# EAGLE design Poke_2_3 (EAGLE 6.5.0)
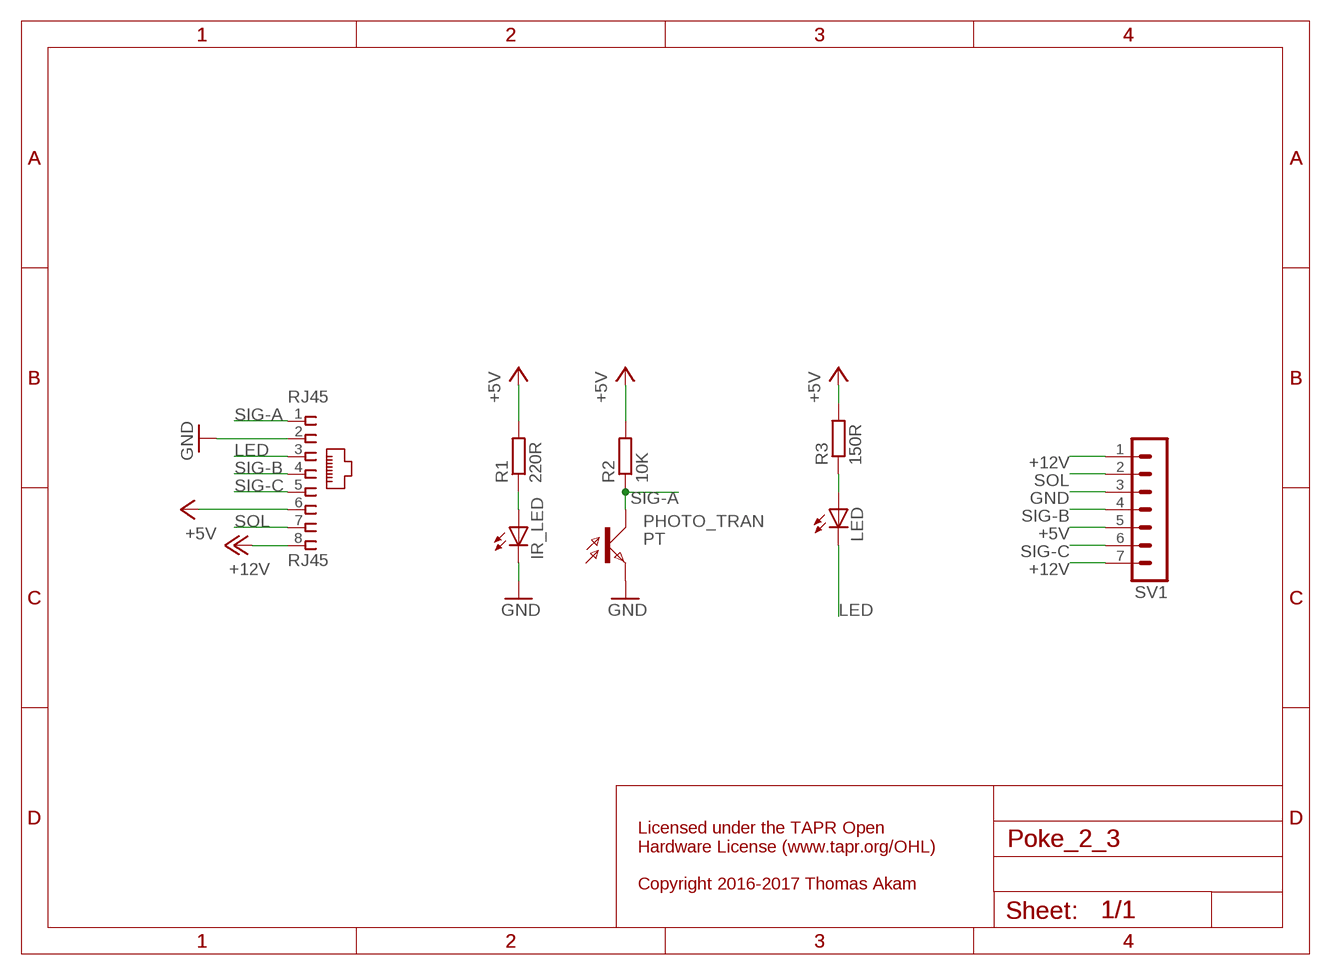
[diagram p0: schematic, sheet 1]

## Parts
IR_LED  LEDIRL80A  [IRL80A]
LED  LEDSML0805  [SML0805]
PHOTO_TRAN  PT  LPT80A  [LPT80A]
R1  220R  R-EU_R0805  [R0805]
R2  10K  R-EU_M0805  [M0805]
R3  150R  R-EU_M0805  [M0805]
RJ45  RJ45  RJ45VERTICAL  [RJ45-NO-SHIELD-VERTICAL]
SV1  MA07-1  [MA07-1]

## Nets
+5V: R1.2 R2.2 R3.2 RJ45.6 SV1.5
+12V: RJ45.8 SV1.1 SV1.7
GND: IR_LED.K(C) PHOTO_TRAN.E RJ45.2 SV1.3
LED: LED.C RJ45.3
N$1: IR_LED.A R1.1
N$10: LED.A R3.1
SIG-A: PHOTO_TRAN.C R2.1 RJ45.1
SIG-B: RJ45.4 SV1.4
SIG-C: RJ45.5 SV1.6
SOL: RJ45.7 SV1.2

## Notes on the sheet
- Licensed under the TAPR Open
  Hardware License (www.tapr.org/OHL)
  
  Copyright 2016-2017 Thomas Akam

## Library data of the parts
IR_LED LED = led:LED: LED OSRAM: - CHIPLED LG R971, LG N971, LY N971, LG Q971, LY Q971, LO R971, LY R971 LH N974, LH R974 LS Q976, LO Q976, LY Q976 LO Q996 - Hyper CHIPLED LW Q18S LB Q993, LB Q99A, LB R99A - SideLED LS A670, LO A670, LY A670, LG A670, LP A670 LB A673, LV A673, LT A673, LW A673 LH A674 LY A675 LS A676, LA A676, LO A676, LY A676, LW A676 LS A679, LY A679, LG A679 - Hyper Micro SIDELED® LS Y876, LA Y876, LO Y876, LY Y876 LT Y87S - SmartLED LW L88C, LW L88S LB L89C, LB L89S, LG L890 LS L89K, LO L89K, LY L89K LS L896, LA L896, LO L896, LY L896 - TOPLED LS T670, LO T670, LY T670, LG T670, LP T670 LSG T670, LSP T670, LSY T670, LOP T670, LYG T670 LG T671, LOG T671, LSG T671 LB T673, LV T673, LT T673, LW T673 LH T674 LS T676, LA T676, LO T676, LY T676, LB T676, LH T676, LSB T676, LW T676 LB T67C, LV T67C, LT T67C, LS T67K, LO T67K, LY T67K, LW E67C LS E67B, LA E67B, LO E67B, LY E67B, LB E67C, LV E67C, LT E67C LW T67C LS T679, LY T679, LG T679 LS T770, LO T770, LY T770, LG T770, LP T770 LB T773, LV T773, LT T773, LW T773 LH T774 LS E675, LA E675, LY E675, LS T675 LS T776, LA T776, LO T776, LY T776, LB T776 LHGB T686 LT T68C, LB T68C - Hyper Mini TOPLED® LB M676 - Mini TOPLED Santana® LG M470 LS M47K, LO M47K, LY M47K Source: http://www.osram.convergy.de LUXEON: - LUMILED® LXK2-PW12-R00, LXK2-PW12-S00, LXK2-PW14-U00, LXK2-PW14-V00 LXK2-PM12-R00, LXK2-PM12-S00, LXK2-PM14-U00 LXK2-PE12-Q00, LXK2-PE12-R00, LXK2-PE12-S00, LXK2-PE14-T00, LXK2-PE14-U00 LXK2-PB12-K00, LXK2-PB12-L00, LXK2-PB12-M00, LXK2-PB14-N00, LXK2-PB14-P00, LXK2-PB14-Q00 LXK2-PR12-L00, LXK2-PR12-M00, LXK2-PR14-Q00, LXK2-PR14-R00 LXK2-PD12-Q00, LXK2-PD12-R00, LXK2-PD12-S00 LXK2-PH12-R00, LXK2-PH12-S00 LXK2-PL12-P00, LXK2-PL12-Q00, LXK2-PL12-R00 Source: www.luxeon.com KINGBRIGHT: KA-3528ASYC Source: www.kingbright.com
PHOTO_TRAN = opto-trans-siemens:LPT80A: PHOTO TRANSISTOR; OC_FARNELL: unknown; OC_NEWARK: unknown
R1-R3 = resistor:R-EU_: RESISTOR, European symbol
RJ45 = con-tycoelectronics-vertical_RJ45:RJ45: CORCOM Modular RJ Jacks No Shield Source: www.tycoelectronics.com .. ENG_DS_1654001_1099_RJ_L_0507.pdf
SV1 = con-lstb:MA07-1: PIN HEADER; OC_FARNELL: unknown; OC_NEWARK: unknown

## Board
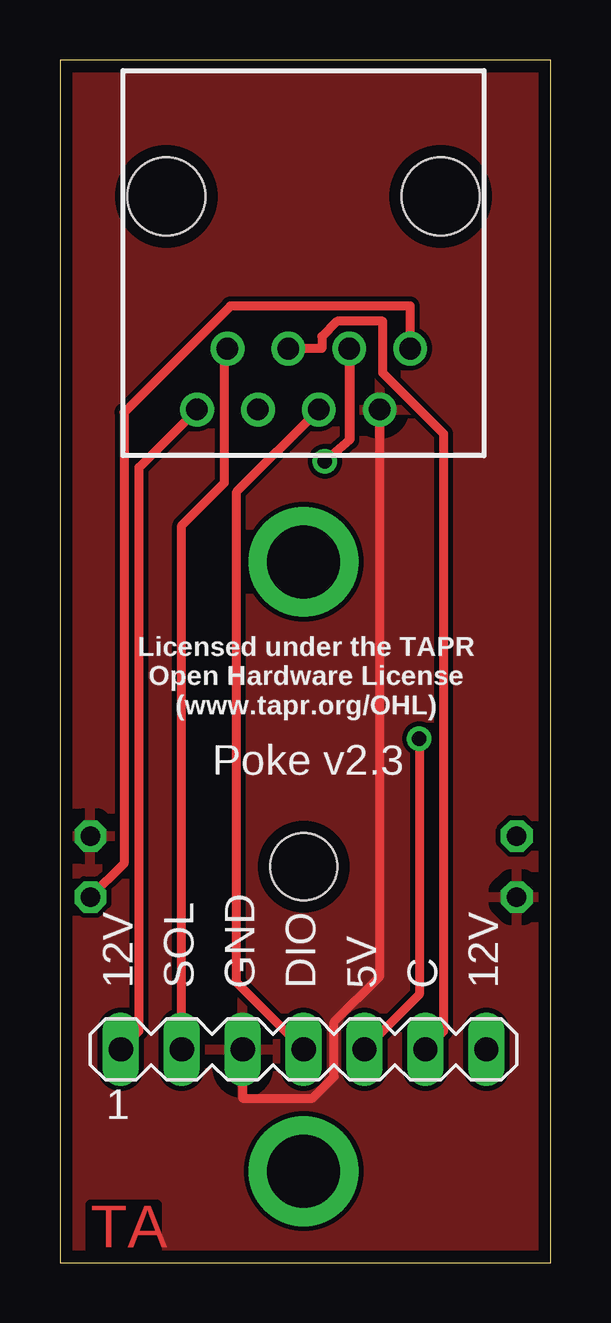
[diagram p1: board, top side]
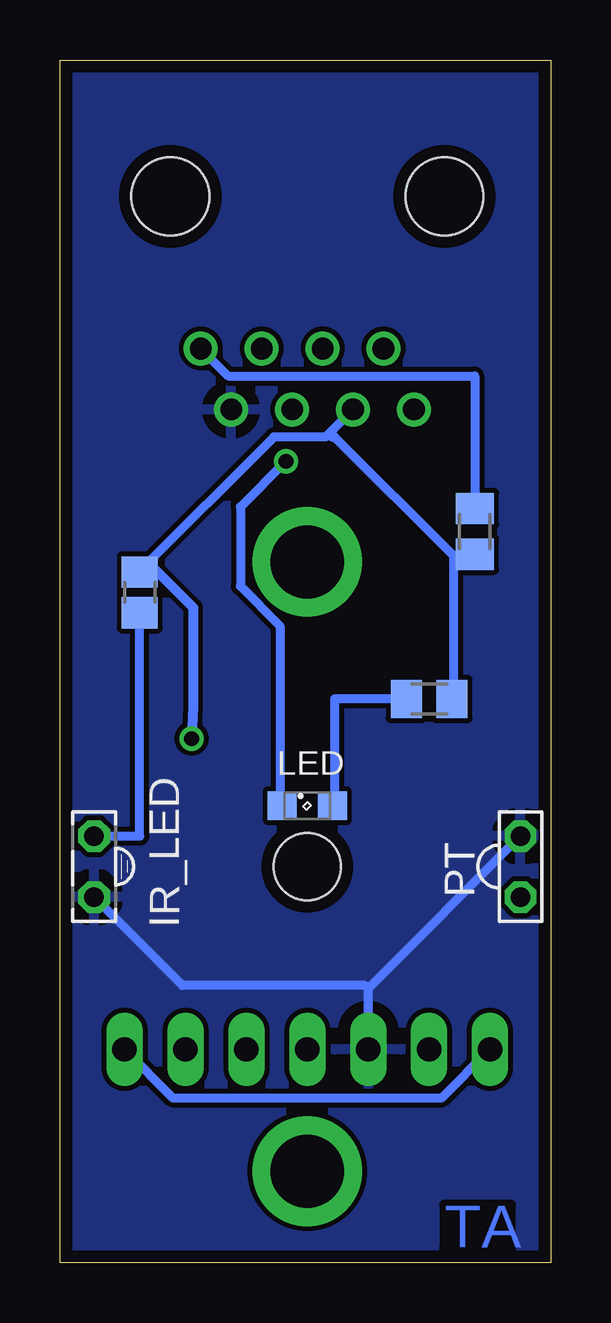
[diagram p2: board, bottom side, seen from below]

Size 20.48 x 50.13 mm. Coordinates in mm from the lower left corner, seen from the top.
Outline: 0,0 20.48,0 20.48,50.13 0,50.13 0,0
Copper layers (1*16): Top 0.035mm / dielectric 1.5mm / Bottom 0.035mm
Design rules "default": minimum track width 15mil, minimum drill 24mil, track to track 8mil, track to pad 8mil, pad to pad 8mil, via to via 8mil, smd to smd 8mil, copper to edge 20mil, drill to drill 8mil, minimum pad ring 10mil, minimum via ring 8mil, stop-mask expansion 4mil, vias tented up to drill 0mil, thermal gap 20mil
Holes 2.8 mm at 10.16,16.51

### Footprints (pad centres in the part's own frame; a part is rotated, then mirrored left to right if it is on the bottom)
IRL80A = drill 0.813 octagon: A 0,-1.27; K 0,1.27
SML0805 = smd 1.2 x 1.2: A 1.05,0; C -1.05,0
LPT80A = drill 0.813 octagon: C 0,-1.27; E 0,1.27
R0805 = smd 1.3 x 1.5: 1 -0.85,0; 2 0.85,0
M0805 = smd 1.3 x 1.6: 1 -0.95,0; 2 0.95,0
RJ45-NO-SHIELD-VERTICAL = drill 0.9 pad 1.4: 1 -4.445,5.08; 2 -3.175,7.62; 3 -1.905,5.08; 4 -0.635,7.62; 5 0.635,5.08; 6 1.905,7.62; 7 3.175,5.08; 8 4.445,7.62 | hole 3.251: -5.715,-1.27; 5.715,-1.27
MA07-1 = drill 1.016 long: 1 -7.62,0; 2 -5.08,0; 3 -2.54,0; 4 0,0; 5 2.54,0; 6 5.08,0; 7 7.62,0

### Placement (x,y rotation side)
IR_LED  19.05,16.51 180 bottom
LED  10.16,19.05 0 bottom
PHOTO_TRAN  1.27,16.51 0 bottom
R1  17.14,27.94 90 bottom
R2  3.17,30.48 270 bottom
R3  5.08,23.5 0 bottom
RJ45  10.16,43.18 180 top
SV1  10.16,8.89 0 top

### Tracks (layer width: path | path; a pad name or v marks a point on that pad's centre or on a via)
+5V  (via drill 0.61)
  Top 0.381: SV1.5 14.99,11.18 v14.99,21.84
  Bottom 0.381: 4.06,29.46 4.06,23.5 R3.2 | 4.06,29.46 3.17,29.46 R2.2 | RJ45.6 9.27,34.54 | 9.27,34.54 9.4,34.42 11.56,34.42 17.14,28.83 R1.2 16.89,28.83 | 4.06,29.46 9.02,34.42 9.14,34.42 9.27,34.54
  Bottom 0.406: 16.89,28.83 16.45,28.83 14.92,27.3 14.92,23.18 v14.99,21.84
+12V
  Top 0.381: RJ45.8 3.3,33.15 3.3,9.65 SV1.1
  Bottom 0.381: SV1.7 15.75,6.86 4.57,6.86 SV1.1
GND
  Top 0.381: RJ45.2 13.34,11.94 11.43,10.03 11.43,7.75 10.54,6.86 7.62,6.86 SV1.3
  Bottom 0.381: 7.62,11.43 PHOTO_TRAN.E | SV1.3 7.62,11.43 | IR_LED.K 15.37,11.56 7.75,11.56 7.62,11.43
  pour Bottom: 0,0 0,49.53 20.32,49.53 20.32,0
  pour Top: 0,49.53 20.32,49.53 20.32,0 0,0
LED  (via drill 0.61)
  Top 0.381: 12.06,34.29 v11.05,33.4
  Top 0.406: RJ45.3 12.06,34.29
  Bottom 0.381: v11.05,33.4 12.95,31.5 12.95,28.19 11.3,26.54 11.3,19.05 LED.C
N$1
  Bottom 0.381: IR_LED.A 17.14,17.78 17.14,27.05 R1.1
N$4  (via drill 3.05 pad 4.57)
  other vias: 10.16,3.81
N$5  (via drill 3.05 pad 4.57)
  other vias: 10.16,29.21
N$10
  Bottom 0.381: LED.A 9.02,19.05 9.02,23.5 6.1,23.5 R3.1
SIG-A
  Top 0.381: PHOTO_TRAN.C 2.67,16.64 2.67,35.43 7.11,39.88 14.61,39.88 RJ45.1
  Bottom 0.381: RJ45.1 13.46,36.96 3.17,36.96 3.17,31.5 R2.1
SIG-B
  Top 0.381: RJ45.4 7.37,32.13 7.37,11.68 SV1.4
SIG-C
  Top 0.381: RJ45.5 10.92,38.1 10.92,38.61 11.56,39.24 13.46,39.24 13.46,37.08 16,34.54 16,9.65 SV1.6
SOL
  Top 0.381: RJ45.7 6.86,37.97 6.86,32.51 5.08,30.73 SV1.2

### Text on the board
Top: TA
Bottom: TA
tPlace: Licensed under the TAPR / Open Hardware License / (www.tapr.org/OHL) | Poke v2.3 | 12V | SOL | GND | DIO | 5V | C | 12V | Licensed under the TAPR Open / Hardware License (www.tapr.org/OHL) / / Copyright 2016-2017 Thomas Akam